# EAGLE design Birthday Badge (EAGLE 6.2)
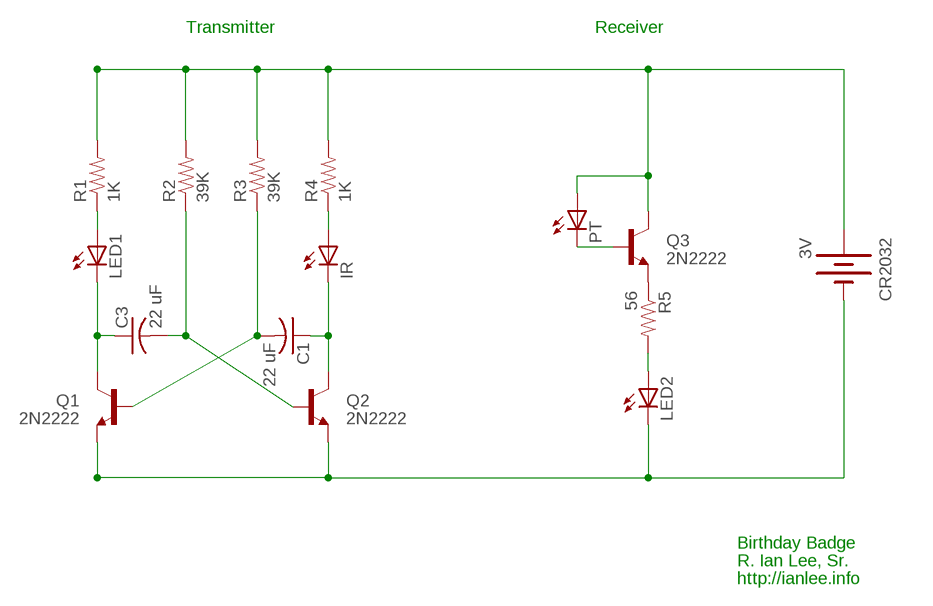
[diagram p0: schematic, sheet 1]

## Parts
C1  22 uF  C-USC1210K  [C1210K]
C3  22 uF  C-USC1210K  [C1210K]
CR2032  3V  BATTERY20SMD  [BATTCON_20MM]
IR  LED5MM  [LED5MM]
LED1  LED5MM  [LED5MM]
LED2  LED5MM  [LED5MM]
PT  LED5MM  [LED5MM]
Q1  2N2222  TRANSISTOR_NPNTO-92-AMMO  [TO-92-AMMO]
Q2  2N2222  TRANSISTOR_NPNTO-92-AMMO  [TO-92-AMMO]
Q3  2N2222  TRANSISTOR_NPNTO-92-AMMO  [TO-92-AMMO]
R1  1K  RESISTORPTH-1/4W  [AXIAL-0.4]
R2  39K  RESISTORPTH-1/4W  [AXIAL-0.4]
R3  39K  RESISTORPTH-1/4W  [AXIAL-0.4]
R4  1K  RESISTORPTH-1/4W  [AXIAL-0.4]
R5  56  RESISTORPTH-1/4W  [AXIAL-0.4]

## Nets
N$1: Q3.1(E) R5.P$1
N$2: CR2032.1(+) PT.A Q3.3(C) R1.P$2 R2.P$2 R3.P$2 R4.P$2
N$4: PT.K(C) Q3.2(B)
N$5: CR2032.2(-) LED2.K(C) Q1.1(E) Q2.1(E)
N$6: LED1.A R1.P$1
N$7: C3.1 LED1.K(C) Q1.3(C)
N$8: IR.A R4.P$1
N$9: C1.1 IR.K(C) Q2.3(C)
N$10: C3.2 Q2.2(B) R2.P$1
N$11: C1.2 Q1.2(B) R3.P$1
N$12: LED2.A R5.P$2

## Notes on the sheet
- Transmitter | Receiver
- Birthday Badge
- R. Ian Lee, Sr.
- http://ianlee.info

## Library data of the parts
C1 C3 = rcl:C-US: CAPACITOR, American symbol
CR2032 = SparkFun:BATTERY: Battery Holders Various common sizes : AA, AAA, 20mm coin cell and 12mm coin cell.
IR LED1 LED2 PT = led:LED: LED OSRAM: - CHIPLED LG R971, LG N971, LY N971, LG Q971, LY Q971, LO R971, LY R971 LH N974, LH R974 LS Q976, LO Q976, LY Q976 LO Q996 - Hyper CHIPLED LW Q18S LB Q993, LB Q99A, LB R99A - SideLED LS A670, LO A670, LY A670, LG A670, LP A670 LB A673, LV A673, LT A673, LW A673 LH A674 LY A675 LS A676, LA A676, LO A676, LY A676, LW A676 LS A679, LY A679, LG A679 - Hyper Micro SIDELED® LS Y876, LA Y876, LO Y876, LY Y876 LT Y87S - SmartLED LW L88C, LW L88S LB L89C, LB L89S, LG L890 LS L89K, LO L89K, LY L89K LS L896, LA L896, LO L896, LY L896 - TOPLED LS T670, LO T670, LY T670, LG T670, LP T670 LSG T670, LSP T670, LSY T670, LOP T670, LYG T670 LG T671, LOG T671, LSG T671 LB T673, LV T673, LT T673, LW T673 LH T674 LS T676, LA T676, LO T676, LY T676, LB T676, LH T676, LSB T676, LW T676 LB T67C, LV T67C, LT T67C, LS T67K, LO T67K, LY T67K, LW E67C LS E67B, LA E67B, LO E67B, LY E67B, LB E67C, LV E67C, LT E67C LW T67C LS T679, LY T679, LG T679 LS T770, LO T770, LY T770, LG T770, LP T770 LB T773, LV T773, LT T773, LW T773 LH T774 LS E675, LA E675, LY E675, LS T675 LS T776, LA T776, LO T776, LY T776, LB T776 LHGB T686 LT T68C, LB T68C - Hyper Mini TOPLED® LB M676 - Mini TOPLED Santana® LG M470 LS M47K, LO M47K, LY M47K Source: http://www.osram.convergy.de LUXEON: - LUMILED® LXK2-PW12-R00, LXK2-PW12-S00, LXK2-PW14-U00, LXK2-PW14-V00 LXK2-PM12-R00, LXK2-PM12-S00, LXK2-PM14-U00 LXK2-PE12-Q00, LXK2-PE12-R00, LXK2-PE12-S00, LXK2-PE14-T00, LXK2-PE14-U00 LXK2-PB12-K00, LXK2-PB12-L00, LXK2-PB12-M00, LXK2-PB14-N00, LXK2-PB14-P00, LXK2-PB14-Q00 LXK2-PR12-L00, LXK2-PR12-M00, LXK2-PR14-Q00, LXK2-PR14-R00 LXK2-PD12-Q00, LXK2-PD12-R00, LXK2-PD12-S00 LXK2-PH12-R00, LXK2-PH12-S00 LXK2-PL12-P00, LXK2-PL12-Q00, LXK2-PL12-R00 Source: www.luxeon.com KINGBRIGHT: KA-3528ASYC Source: www.kingbright.com
Q1-Q3 = SparkFun:TRANSISTOR_NPN: Transistor NPN BJT configuration in SOT23 package. MMBT2222 is the common NPN we use. Double check BCE configuration again layout.
R1-R5 = SparkFun:RESISTOR: Resistor Basic schematic elements and footprints for 0603, 1206, and PTH resistors.

## Board
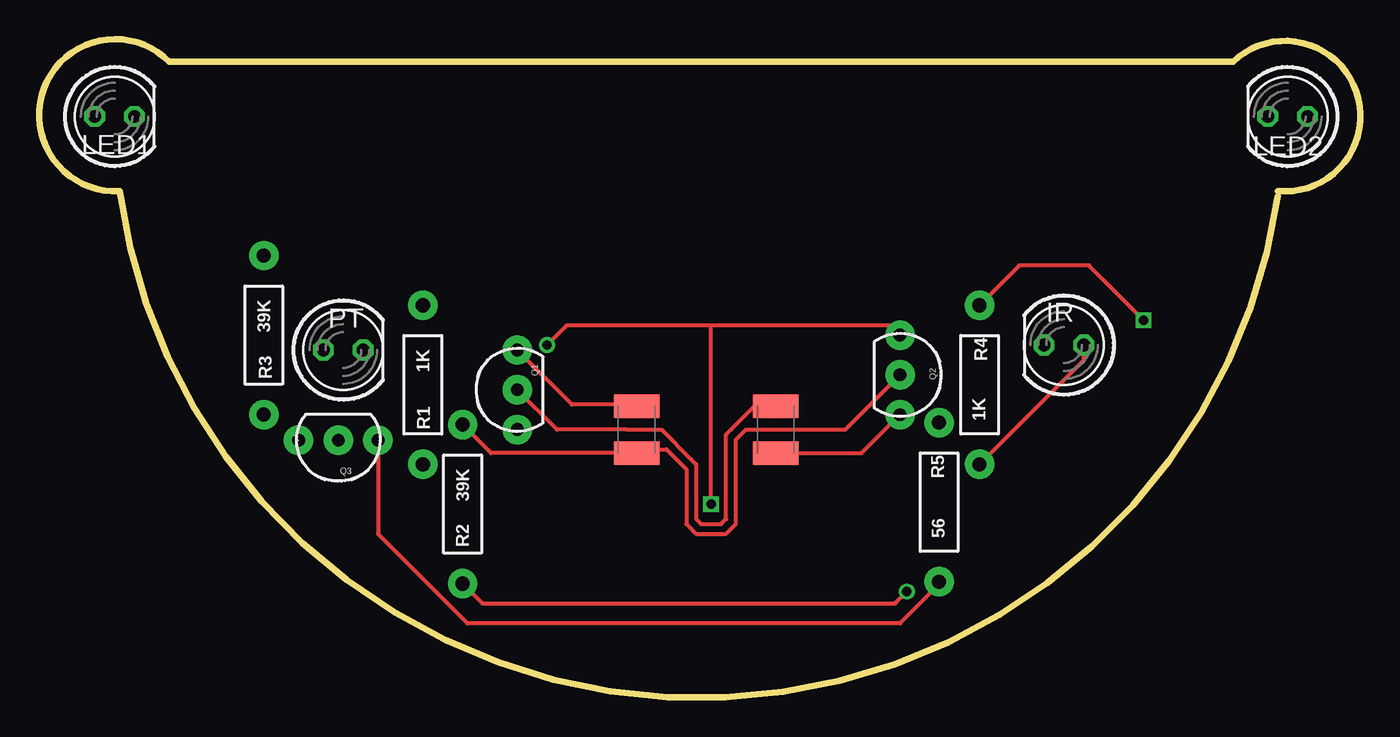
[diagram p1: board, top side]
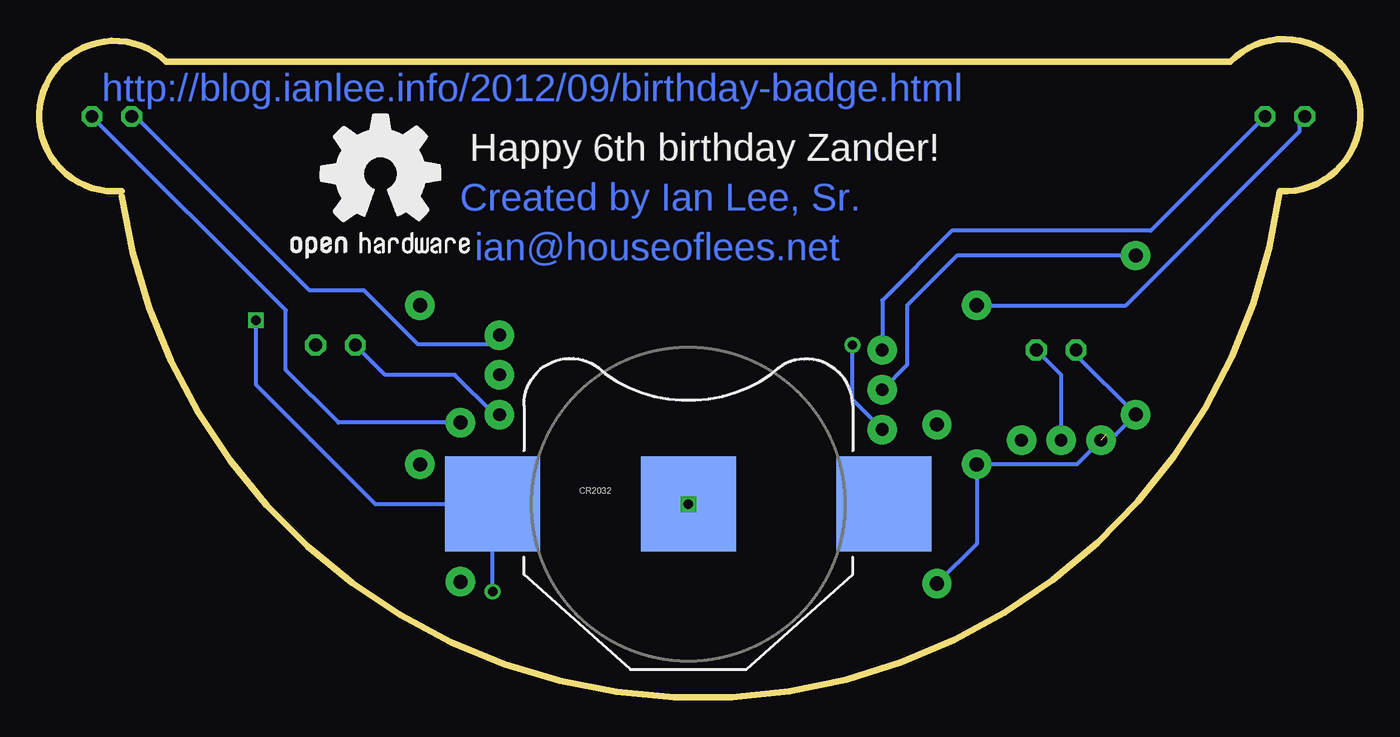
[diagram p2: board, bottom side, seen from below]

Size 84.39 x 42.06 mm. Coordinates in mm from the lower left corner, seen from the top.
Outline: 79.12,32.04 arc-164 5.14,32.36 arc-229 8.31,40.61 76.26,40.61 arc-229 79.12,32.36
Copper layers (1*16): Top 0.035mm / dielectric 1.5mm / Bottom 0.035mm
Design rules: minimum track width 6mil, minimum drill 13mil, track to track 8mil, track to pad 8mil, pad to pad 8mil, via to via 8mil, smd to smd 8mil, copper to edge 40mil, drill to drill 8mil, minimum pad ring 10mil, minimum via ring 8mil, stop-mask expansion 4mil, vias tented up to drill 0mil, thermal gap 10mil

### Footprints (pad centres in the part's own frame; a part is rotated, then mirrored left to right if it is on the bottom)
C1210K = smd 1.5 x 2.9: 1 -1.5,0; 2 1.5,0
BATTCON_20MM = smd 6.07 x 6.07: 1 -12.5,0; 2 0,0; 3 12.5,0
LED5MM = drill 0.813 octagon: A -1.27,0; K 1.27,0
TO-92-AMMO = drill 0.813 pad 1.88: 1 -2.54,0; 2 0,0; 3 2.54,0
AXIAL-0.4 = drill 0.9 pad 1.88: P$1 -5.08,0; P$2 5.08,0

### Placement (x,y rotation side)
C1  47.05,17.12 90 top
C3  38.16,17.12 270 top
CR2032  42.92,12.36 0 bottom
IR  65.46,22.52 180 top
LED1  4.82,37.12 0 top
LED2  79.75,37.12 180 top
PT  19.43,22.2 0 top
Q1  30.54,19.66 90 top
Q2  54.99,20.61 270 top
Q3  19.11,16.43 180 top
R1  24.51,19.98 270 top
R2  27.05,12.36 270 top
R3  14.35,23.15 270 top
R4  60.07,19.98 90 top
R5  57.48,12.48 90 top
U$1  [OSHW1]  68.96,26.33 0 bottom

### Tracks (layer width: path | path; a pad name or v marks a point on that pad's centre or on a via)
N$1
  Top 0.254: Q3.1 21.65,10.45 27.36,4.74 54.99,4.74 57.48,7.23 R5.P$1
N$2  (via drill 0.6)  (1 unrouted)
  Top 0.254: v70.54,24.1 67.05,27.6 62.61,27.6 R4.P$2 | R2.P$2 28.32,6.01 54.67,6.01 v55.42,6.76
  Bottom 0.254: 16.25,16.8 15.62,16.8 R3.P$2 18.16,21.88 PT.A | R2.P$2 24.51,9.82 R1.P$2 18.1,14.9 Q3.3 | v70.54,24.1 70.54,19.98 67.05,16.48 62.92,12.36 CR2032.1 v55.42,6.76
N$4
  Bottom 0.254: Q3.2 19.11,20.61 PT.K
N$5  (via drill 0.6)
  Top 0.254: v32.44,22.52 33.71,23.79 42.92,23.79 | CR2032.2 42.92,23.79 | 42.92,23.79 52.13,23.79 54.35,23.79 Q2.1
  Bottom 0.254: LED2.K 78.22,37.12 67.11,26.01 63.64,26.01 60.22,22.58 55.55,22.58 Q2.1 | Q1.1 32.44,19.02 v32.44,22.52
  other vias: 42.92,12.36
N$6
  Bottom 0.254: R1.P$1 14.98,25.06 3.87,36.17 3.87,36.8 LED1.A
N$7
  Top 0.254: C3.1 38.07,18.71 34.03,18.71 Q1.3
  Bottom 0.254: LED1.K 12.91,30.31 13.39,29.82 26.09,29.82 30.54,25.37 Q1.3
N$8
  Top 0.254: R4.P$1 66.73,21.56 IR.A
N$9
  Top 0.254: C1.1 52.53,15.62 Q2.3
  Bottom 0.254: 64.19,22.2 IR.K 62.29,20.61 57.84,20.61 55.3,18.07 Q2.3
N$10
  Top 0.254: R2.P$1 28.86,15.62 C3.2 38.39,15.85 40.06,15.85 41.02,14.9 41.33,14.58 41.33,11.09 41.97,10.45 43.87,10.45 44.51,11.09 44.51,16.48 45.14,17.12 49.91,17.12 51.49,17.12 Q2.2
N$11
  Top 0.254: Q1.2 33.08,17.12 37.52,17.12 39.75,17.12 41.65,15.21 41.97,14.9 41.97,11.4 42.29,11.09 43.56,11.09 43.87,11.4 43.87,16.8 44.19,17.12 45.69,18.62 | 45.69,18.62 46.1,18.62 | 46.1,18.62 C1.2 | 45.69,18.62 46.1,18.62
  Bottom 0.254: R3.P$1 25.78,28.23 28.95,25.06 28.95,21.25 Q1.2
N$12
  Bottom 0.254: LED2.A 68.64,24.74 68.64,20.93 65.27,17.56 R5.P$2

### Text on the board
Bottom: http://blog.ianlee.info/2012/09/birthday-badge.html | Created by Ian Lee, Sr. | ian@houseoflees.net
_bsilk: Happy 6th birthday Zander!